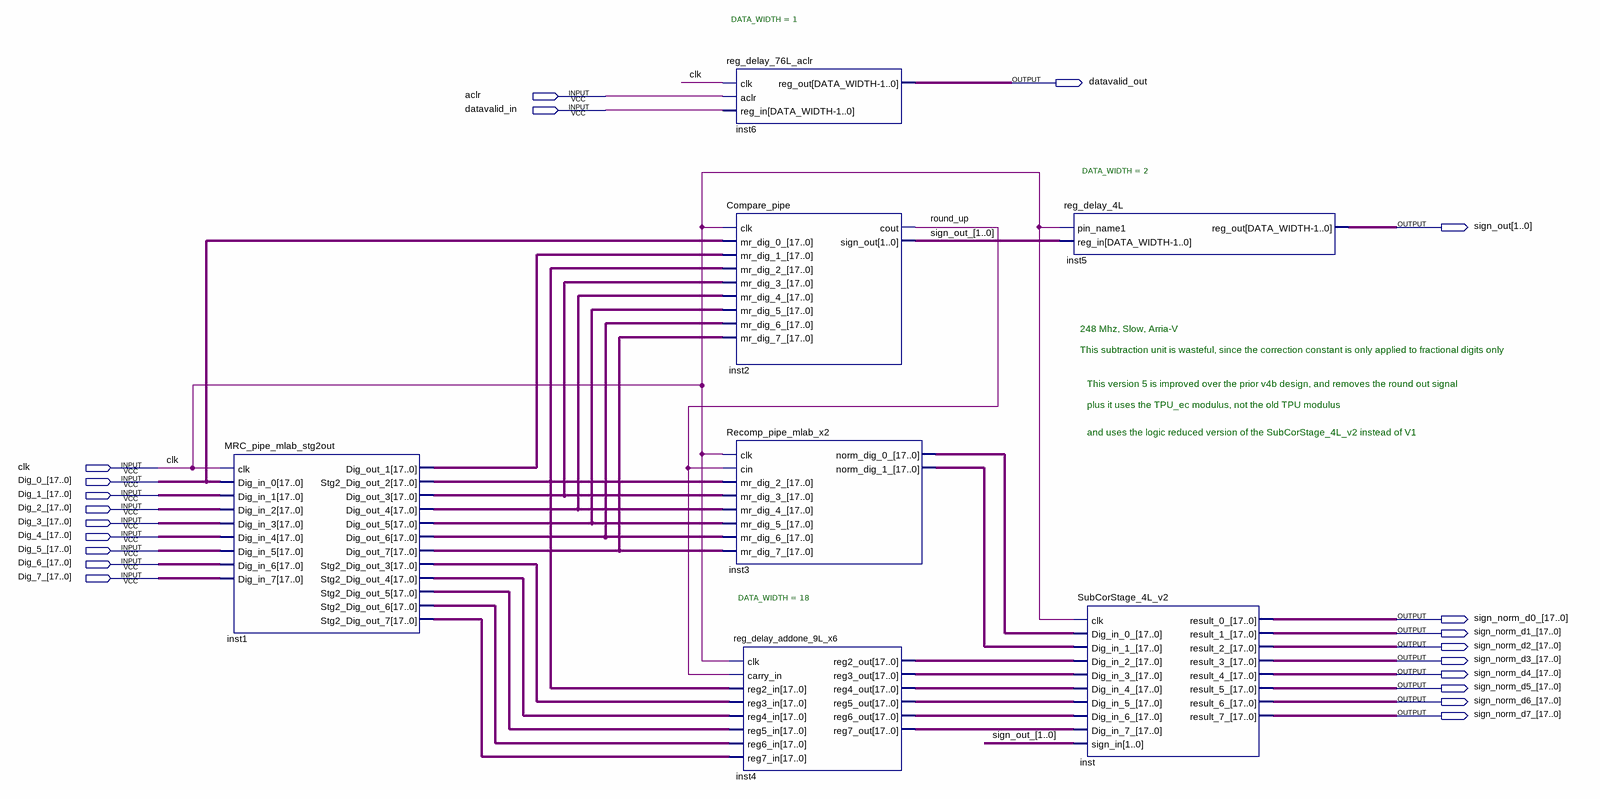
[diagram p0: schematic sheet]
// Quartus schematic Full_Norm_pipe8x18_dval.bdf as structural Verilog: 7 symbols, 21 pins
module Full_Norm_pipe8x18_dval (
  input  aclr,
  input  datavalid_in,
  input  clk,
  input  [17:0] Dig_0_,
  input  [17:0] Dig_1_,
  input  [17:0] Dig_2_,
  input  [17:0] Dig_3_,
  input  [17:0] Dig_4_,
  input  [17:0] Dig_5_,
  input  [17:0] Dig_6_,
  input  [17:0] Dig_7_,
  output datavalid_out,
  output [1:0] sign_out,
  output [17:0] sign_norm_d0_,
  output [17:0] sign_norm_d1_,
  output [17:0] sign_norm_d2_,
  output [17:0] sign_norm_d3_,
  output [17:0] sign_norm_d4_,
  output [17:0] sign_norm_d5_,
  output [17:0] sign_norm_d6_,
  output [17:0] sign_norm_d7_
);

  wire round_up;
  wire [1:0] sign_out_;
  wire [17:0] inst1_dig_out_1, inst1_dig_out_3, inst1_dig_out_4, inst1_dig_out_5, inst1_dig_out_6,
       inst1_dig_out_7, inst1_stg2_dig_out_2, inst1_stg2_dig_out_3, inst1_stg2_dig_out_4,
       inst1_stg2_dig_out_5, inst1_stg2_dig_out_6, inst1_stg2_dig_out_7, inst3_norm_dig_0_,
       inst3_norm_dig_1_, inst4_reg2_out, inst4_reg3_out, inst4_reg4_out, inst4_reg5_out, inst4_reg6_out,
       inst4_reg7_out;

  MRC_pipe_mlab_stg2out inst1 (
    .clk(clk), .Dig_in_0(Dig_0_), .Dig_in_1(Dig_1_), .Dig_in_2(Dig_2_), .Dig_in_3(Dig_3_), .Dig_in_4(Dig_4_),
    .Dig_in_5(Dig_5_), .Dig_in_6(Dig_6_), .Dig_in_7(Dig_7_), .Dig_out_1(inst1_dig_out_1),
    .Dig_out_3(inst1_dig_out_3), .Dig_out_4(inst1_dig_out_4), .Dig_out_5(inst1_dig_out_5),
    .Dig_out_6(inst1_dig_out_6), .Dig_out_7(inst1_dig_out_7), .Stg2_Dig_out_2(inst1_stg2_dig_out_2),
    .Stg2_Dig_out_3(inst1_stg2_dig_out_3), .Stg2_Dig_out_4(inst1_stg2_dig_out_4),
    .Stg2_Dig_out_5(inst1_stg2_dig_out_5), .Stg2_Dig_out_6(inst1_stg2_dig_out_6),
    .Stg2_Dig_out_7(inst1_stg2_dig_out_7));
  reg_delay_76L_aclr #(.DATA_WIDTH(1)) inst6 (.clk(clk), .aclr(aclr), .reg_in(datavalid_in), .reg_out(datavalid_out));
  Compare_pipe inst2 (
    .clk(clk), .mr_dig_0_(Dig_0_), .mr_dig_1_(inst1_dig_out_1), .mr_dig_2_(inst1_stg2_dig_out_2),
    .mr_dig_3_(inst1_dig_out_3), .mr_dig_4_(inst1_dig_out_4), .mr_dig_5_(inst1_dig_out_5),
    .mr_dig_6_(inst1_dig_out_6), .mr_dig_7_(inst1_dig_out_7), .cout(round_up), .sign_out(sign_out_));
  Recomp_pipe_mlab_x2 inst3 (
    .clk(clk), .cin(round_up), .mr_dig_2_(inst1_stg2_dig_out_2), .mr_dig_3_(inst1_dig_out_3),
    .mr_dig_4_(inst1_dig_out_4), .mr_dig_5_(inst1_dig_out_5), .mr_dig_6_(inst1_dig_out_6),
    .mr_dig_7_(inst1_dig_out_7), .norm_dig_0_(inst3_norm_dig_0_), .norm_dig_1_(inst3_norm_dig_1_));
  reg_delay_addone_9L_x6 #(.DATA_WIDTH(18)) inst4 (
    .clk(clk), .carry_in(round_up), .reg2_in(inst1_stg2_dig_out_2), .reg3_in(inst1_stg2_dig_out_3),
    .reg4_in(inst1_stg2_dig_out_4), .reg5_in(inst1_stg2_dig_out_5), .reg6_in(inst1_stg2_dig_out_6),
    .reg7_in(inst1_stg2_dig_out_7), .reg2_out(inst4_reg2_out), .reg3_out(inst4_reg3_out),
    .reg4_out(inst4_reg4_out), .reg5_out(inst4_reg5_out), .reg6_out(inst4_reg6_out), .reg7_out(inst4_reg7_out));
  reg_delay_4L #(.DATA_WIDTH(2)) inst5 (.pin_name1(clk), .reg_in(sign_out_), .reg_out(sign_out));
  SubCorStage_4L_v2 inst (
    .clk(clk), .Dig_in_0_(inst3_norm_dig_0_), .Dig_in_1_(inst3_norm_dig_1_), .Dig_in_2_(inst4_reg2_out),
    .Dig_in_3_(inst4_reg3_out), .Dig_in_4_(inst4_reg4_out), .Dig_in_5_(inst4_reg5_out),
    .Dig_in_6_(inst4_reg6_out), .Dig_in_7_(inst4_reg7_out), .sign_in(sign_out_), .result_0_(sign_norm_d0_),
    .result_1_(sign_norm_d1_), .result_2_(sign_norm_d2_), .result_3_(sign_norm_d3_),
    .result_4_(sign_norm_d4_), .result_5_(sign_norm_d5_), .result_6_(sign_norm_d6_), .result_7_(sign_norm_d7_));

  // Notes on the sheet:
  //   248 Mhz, Slow, Arria-V
  //   This subtraction unit is wasteful, since the correction constant is only applied to fractional digits only
  //   This version 5 is improved over the prior v4b design, and removes the round out signal
  //   plus it uses the TPU_ec modulus, not the old TPU modulus
  //   and uses the logic reduced version of the SubCorStage_4L_v2 instead of V1
endmodule
